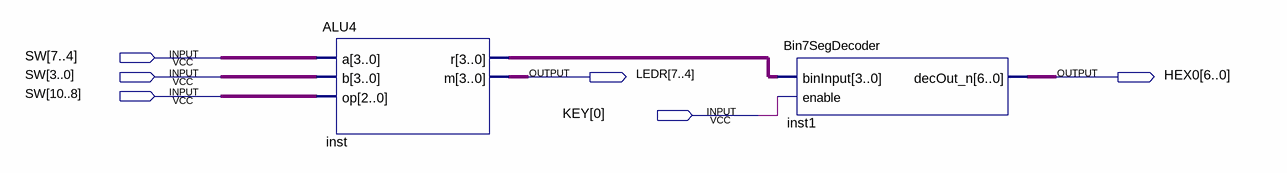
[diagram p0: schematic sheet]
// Quartus schematic ALUDemo.bdf as structural Verilog: 2 symbols, 6 pins
module ALUDemo (
  input  [10:0] SW,
  input  [0:0] KEY,
  output [7:4] LEDR,
  output [6:0] HEX0
);

  wire [3:0] inst_r;

  ALU4 inst (.a(SW[7:4]), .b(SW[3:0]), .op(SW[10:8]), .r(inst_r), .m(LEDR));
  Bin7SegDecoder inst1 (.binInput(inst_r), .enable(KEY[0]), .decOut_n(HEX0));
endmodule
